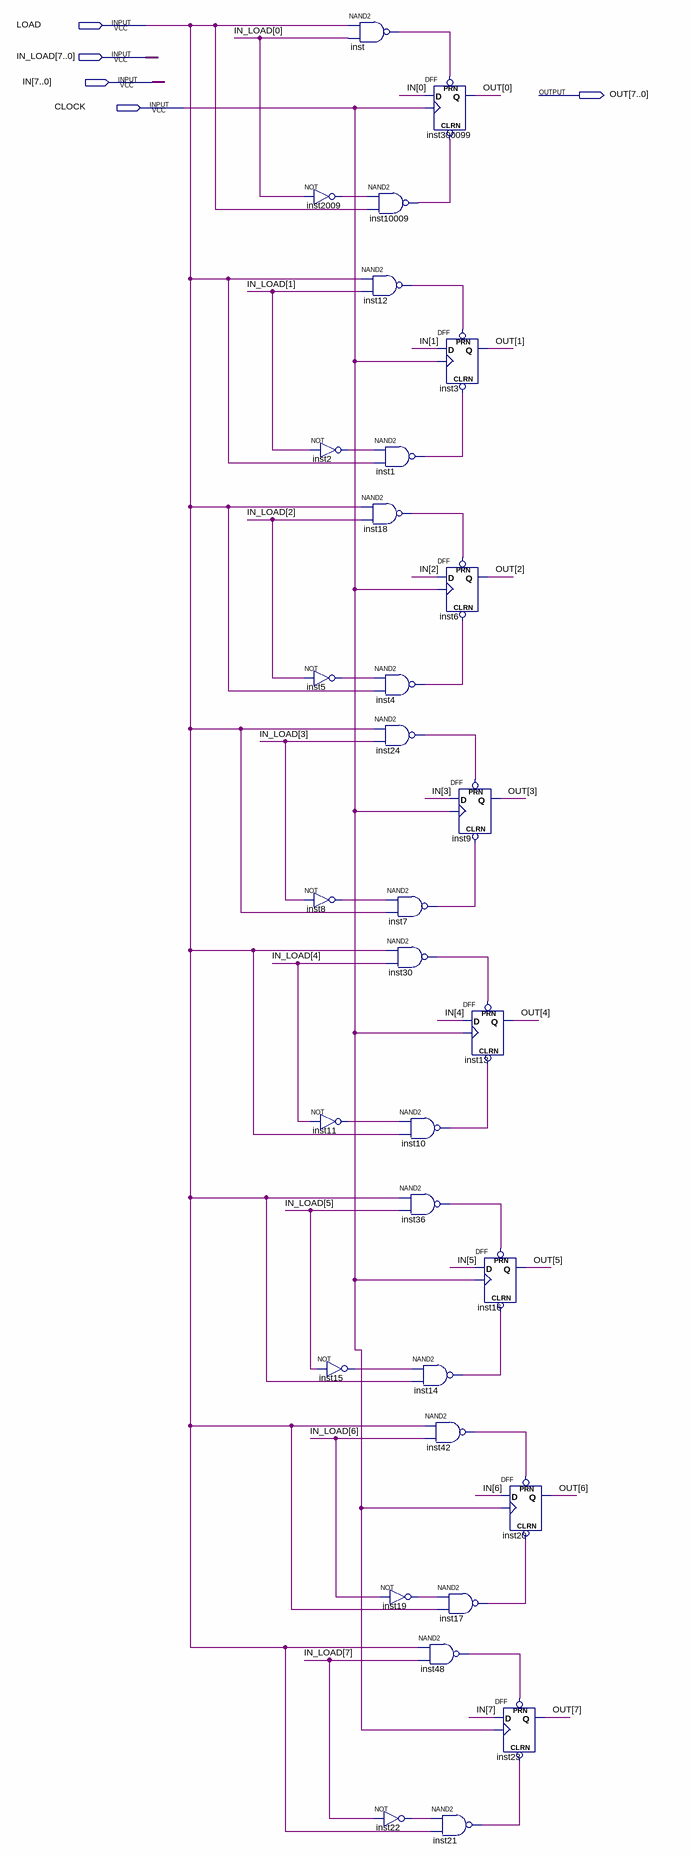
[diagram p0: schematic sheet]
// Quartus schematic REGISTER_8bit.bdf as structural Verilog: 32 symbols, 5 pins
module REGISTER_8bit (
  input  LOAD,
  input  [7:0] IN_LOAD,
  input  [7:0] IN,
  input  CLOCK,
  output [7:0] OUT
);

  wire inst1_out, inst2_out, inst4_out, inst5_out, inst7_out, inst8_out, inst10_out, inst11_out, inst12_out,
       inst14_out, inst15_out, inst17_out, inst18_out, inst19_out, inst21_out, inst22_out, inst24_out,
       inst30_out, inst36_out, inst42_out, inst48_out, inst2009_out, inst10009_out, inst_out;

  nand inst (inst_out, LOAD, IN_LOAD[0]);
  not inst2009 (inst2009_out, IN_LOAD[0]);
  not inst2 (inst2_out, IN_LOAD[1]);
  not inst5 (inst5_out, IN_LOAD[2]);
  not inst8 (inst8_out, IN_LOAD[3]);
  not inst11 (inst11_out, IN_LOAD[4]);
  not inst15 (inst15_out, IN_LOAD[5]);
  nand inst10009 (inst10009_out, inst2009_out, LOAD);
  nand inst12 (inst12_out, LOAD, IN_LOAD[1]);
  nand inst1 (inst1_out, inst2_out, LOAD);
  nand inst18 (inst18_out, LOAD, IN_LOAD[2]);
  nand inst4 (inst4_out, inst5_out, LOAD);
  nand inst24 (inst24_out, LOAD, IN_LOAD[3]);
  nand inst7 (inst7_out, inst8_out, LOAD);
  nand inst30 (inst30_out, LOAD, IN_LOAD[4]);
  nand inst10 (inst10_out, inst11_out, LOAD);
  nand inst36 (inst36_out, LOAD, IN_LOAD[5]);
  not inst19 (inst19_out, IN_LOAD[6]);
  not inst22 (inst22_out, IN_LOAD[7]);
  DFF inst300099 (.CLRN(inst10009_out), .CLK(CLOCK), .D(IN[0]), .PRN(inst_out), .Q(OUT[0]));
  DFF inst3 (.CLRN(inst1_out), .CLK(CLOCK), .D(IN[1]), .PRN(inst12_out), .Q(OUT[1]));
  DFF inst6 (.CLRN(inst4_out), .CLK(CLOCK), .D(IN[2]), .PRN(inst18_out), .Q(OUT[2]));
  DFF inst9 (.CLRN(inst7_out), .CLK(CLOCK), .D(IN[3]), .PRN(inst24_out), .Q(OUT[3]));
  nand inst14 (inst14_out, inst15_out, LOAD);
  nand inst42 (inst42_out, LOAD, IN_LOAD[6]);
  nand inst17 (inst17_out, inst19_out, LOAD);
  nand inst48 (inst48_out, LOAD, IN_LOAD[7]);
  nand inst21 (inst21_out, inst22_out, LOAD);
  DFF inst13 (.CLRN(inst10_out), .CLK(CLOCK), .D(IN[4]), .PRN(inst30_out), .Q(OUT[4]));
  DFF inst16 (.CLRN(inst14_out), .CLK(CLOCK), .D(IN[5]), .PRN(inst36_out), .Q(OUT[5]));
  DFF inst20 (.CLRN(inst17_out), .CLK(CLOCK), .D(IN[6]), .PRN(inst42_out), .Q(OUT[6]));
  DFF inst23 (.CLRN(inst21_out), .CLK(CLOCK), .D(IN[7]), .PRN(inst48_out), .Q(OUT[7]));
endmodule
